# Altium schematic sheet ENCODER.SchDoc
size A
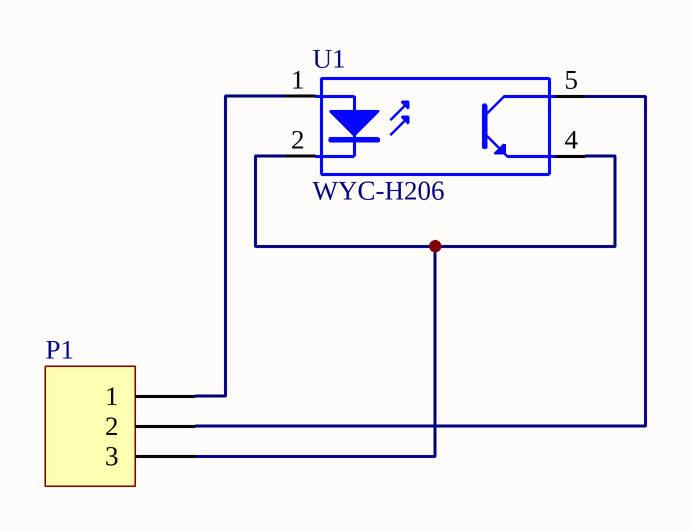
[diagram p0: ENCODER.SchDoc]

## Parts
P1  Header 3  [CONN-3POS-PITCH2.54MM]  (value not drawn)
U1  WYC-H206  [ENCODER-WYC-H206]

## Nets
NetP1_1: P1.1 U1.1(A)
NetP1_2: P1.2 U1.5(C)
NetP1_3: P1.3 U1.2(K) U1.4(E)

## Library data of the parts
P1 = Header 3: Header, 3-Pin
U1 = Optoisolator1: 4-Pin Phototransistor Optocoupler